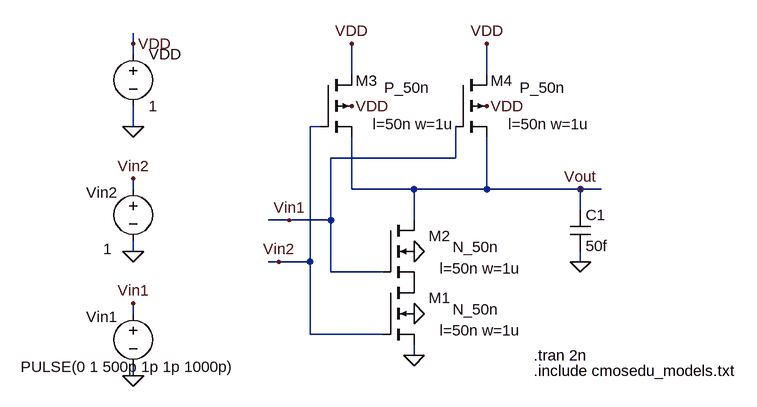
[diagram p0: schematic 5-NAND2.asc]
5-NAND2.asc, the LTspice schematic file:
Version 4
SHEET 1 1136 680
WIRE 160 -496 160 -512
WIRE 160 -480 160 -496
WIRE 496 -448 496 -496
WIRE 704 -448 704 -496
WIRE 160 -368 160 -400
WIRE 448 -368 432 -368
WIRE 656 -320 656 -368
WIRE 656 -320 464 -320
WIRE 160 -272 160 -288
WIRE 496 -272 496 -352
WIRE 592 -272 496 -272
WIRE 704 -272 704 -352
WIRE 704 -272 592 -272
WIRE 848 -272 704 -272
WIRE 880 -272 848 -272
WIRE 848 -240 848 -272
WIRE 400 -224 368 -224
WIRE 464 -224 464 -320
WIRE 464 -224 400 -224
WIRE 592 -224 592 -272
WIRE 160 -176 160 -192
WIRE 384 -160 368 -160
WIRE 432 -160 432 -368
WIRE 432 -160 384 -160
WIRE 848 -160 848 -176
WIRE 464 -144 464 -224
WIRE 544 -144 464 -144
WIRE 160 -80 160 -96
WIRE 432 -48 432 -160
WIRE 544 -48 432 -48
WIRE 592 -16 592 -32
WIRE 160 16 160 0
FLAG 160 16 0
FLAG 160 -96 Vin1
FLAG 592 -176 0
FLAG 160 -368 0
FLAG 160 -496 VDD
FLAG 496 -400 VDD
FLAG 592 -16 0
FLAG 496 -496 VDD
FLAG 848 -272 Vout
FLAG 704 -400 VDD
FLAG 704 -496 VDD
FLAG 592 -80 0
FLAG 848 -160 0
FLAG 400 -224 Vin1
FLAG 384 -160 Vin2
FLAG 160 -176 0
FLAG 160 -288 Vin2
SYMBOL voltage 160 -96 R0
WINDOW 0 -72 21 Left 2
WINDOW 3 -173 98 Left 2
WINDOW 123 0 0 Left 2
WINDOW 39 0 0 Left 2
SYMATTR InstName Vin1
SYMATTR Value PULSE(0 1 500p 1p 1p 1000p)
SYMBOL voltage 160 -496 R0
WINDOW 123 0 0 Left 2
WINDOW 39 0 0 Left 2
SYMATTR InstName VDD
SYMATTR Value 1
SYMBOL pmos4 448 -448 R0
WINDOW 0 88 9 Right 2
WINDOW 3 168 20 Right 2
WINDOW 123 206 76 Right 2
SYMATTR InstName M3
SYMATTR Value P_50n
SYMATTR Value2 l=50n w=1u
SYMBOL nmos4 544 -128 R0
WINDOW 0 104 24 Right 2
WINDOW 3 179 41 Right 2
WINDOW 123 213 74 Right 2
SYMATTR InstName M1
SYMATTR Value N_50n
SYMATTR Value2 l=50n w=1u
SYMBOL nmos4 544 -224 R0
WINDOW 0 104 24 Right 2
WINDOW 3 179 41 Right 2
WINDOW 123 213 74 Right 2
SYMATTR InstName M2
SYMATTR Value N_50n
SYMATTR Value2 l=50n w=1u
SYMBOL pmos4 656 -448 R0
WINDOW 0 88 9 Right 2
WINDOW 3 168 20 Right 2
WINDOW 123 206 76 Right 2
SYMATTR InstName M4
SYMATTR Value P_50n
SYMATTR Value2 l=50n w=1u
SYMBOL cap 832 -240 R0
SYMATTR InstName C1
SYMATTR Value 50f
SYMBOL voltage 160 -288 R0
WINDOW 0 -72 21 Left 2
WINDOW 3 -46 108 Left 2
WINDOW 123 0 0 Left 2
WINDOW 39 0 0 Left 2
SYMATTR InstName Vin2
SYMATTR Value 1
TEXT 776 -16 Left 2 !.tran 2n
TEXT 776 8 Left 2 !.include cmosedu_models.txt

The netlist it stands for:
* 5-NAND2.asc
Vin1 Vin1 0 PULSE(0 1 500p 1p 1p 1000p)
VDD VDD 0 1
M3 VDD Vin2 Vout VDD P_50n l=50n w=1u
M1 P001 Vin2 0 0 N_50n l=50n w=1u
M2 Vout Vin1 P001 0 N_50n l=50n w=1u
M4 VDD Vin1 Vout VDD P_50n l=50n w=1u
C1 Vout 0 50f
Vin2 Vin2 0 1
.model NMOS NMOS
.model PMOS PMOS
.lib standard.mos
.tran 2n
.include cmosedu_models.txt
.backanno
.end